# Altium project ESP32_DevBoard_B.PrjPcb
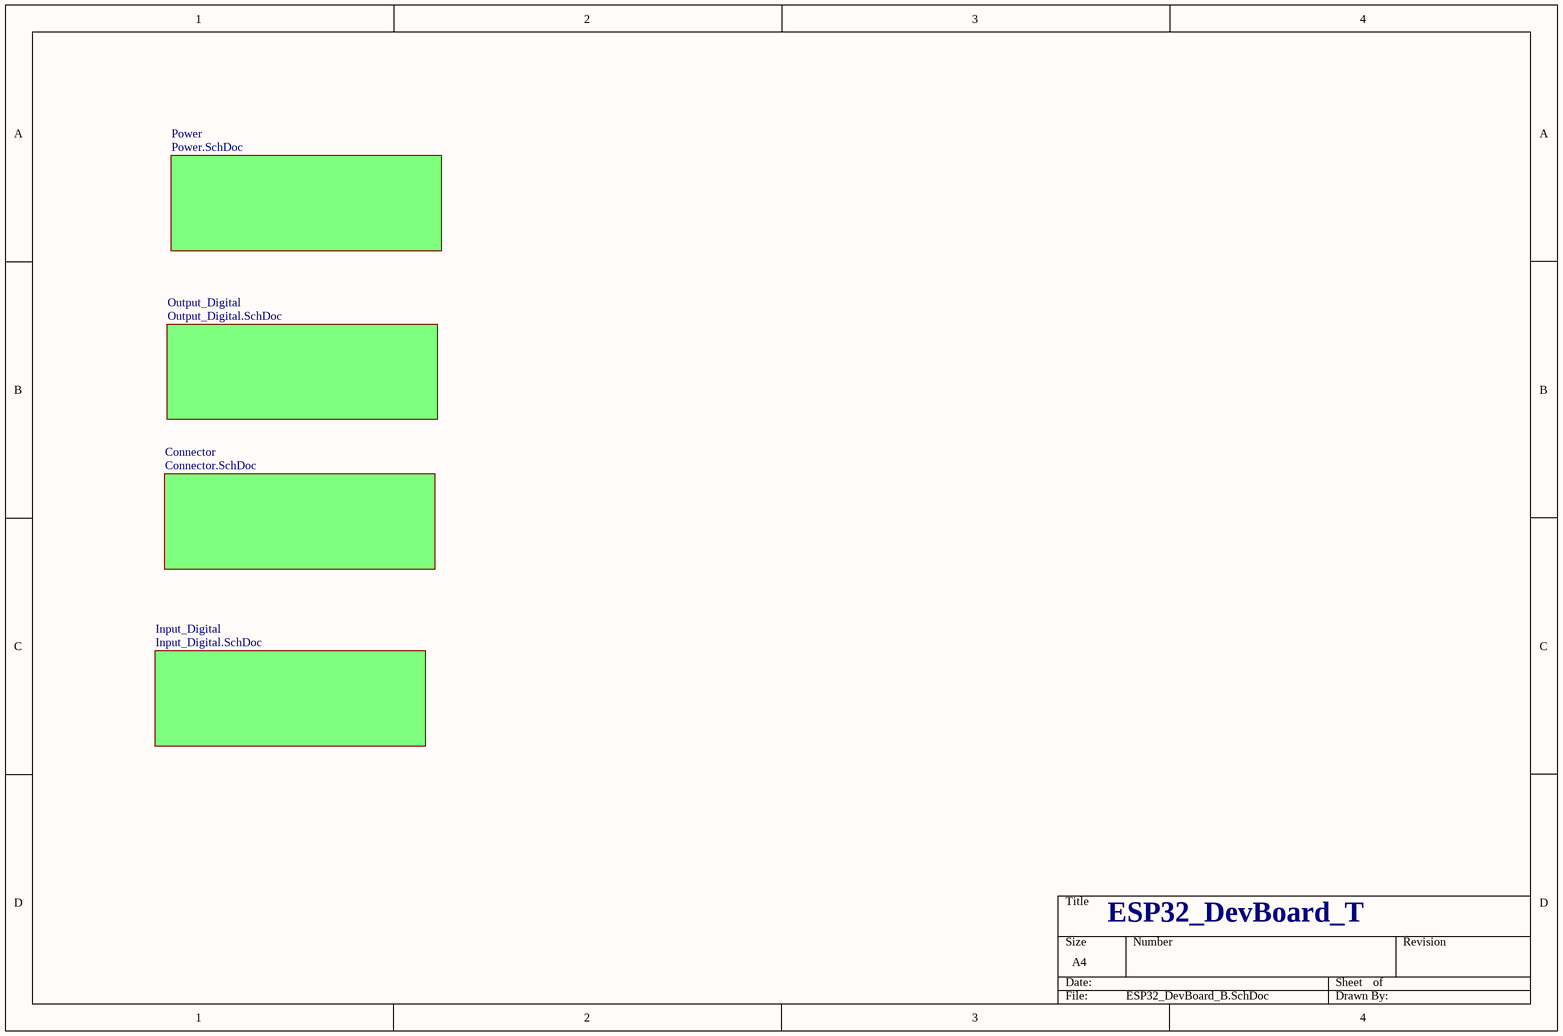
[diagram p0: ESP32_DevBoard_B.SchDoc]
5 sheets, 46 parts. Net scope: flat (ports and power ports of the same name join across sheets).
Sheets:
  ESP32_DevBoard_B.SchDoc
    Power = Power.SchDoc
    Output_Digital = Output_Digital.SchDoc
    Connector = Connector.SchDoc
    Input_Digital = Input_Digital.SchDoc

## Sheet ESP32_DevBoard_B.SchDoc
size A4

### Sub-sheets
Connector = Connector.SchDoc: no entries
Input_Digital = Input_Digital.SchDoc: no entries
Output_Digital = Output_Digital.SchDoc: no entries
Power = Power.SchDoc: no entries

### Notes on the sheet
- ESP32_DevBoard_T

## Sheet Power.SchDoc
size A4
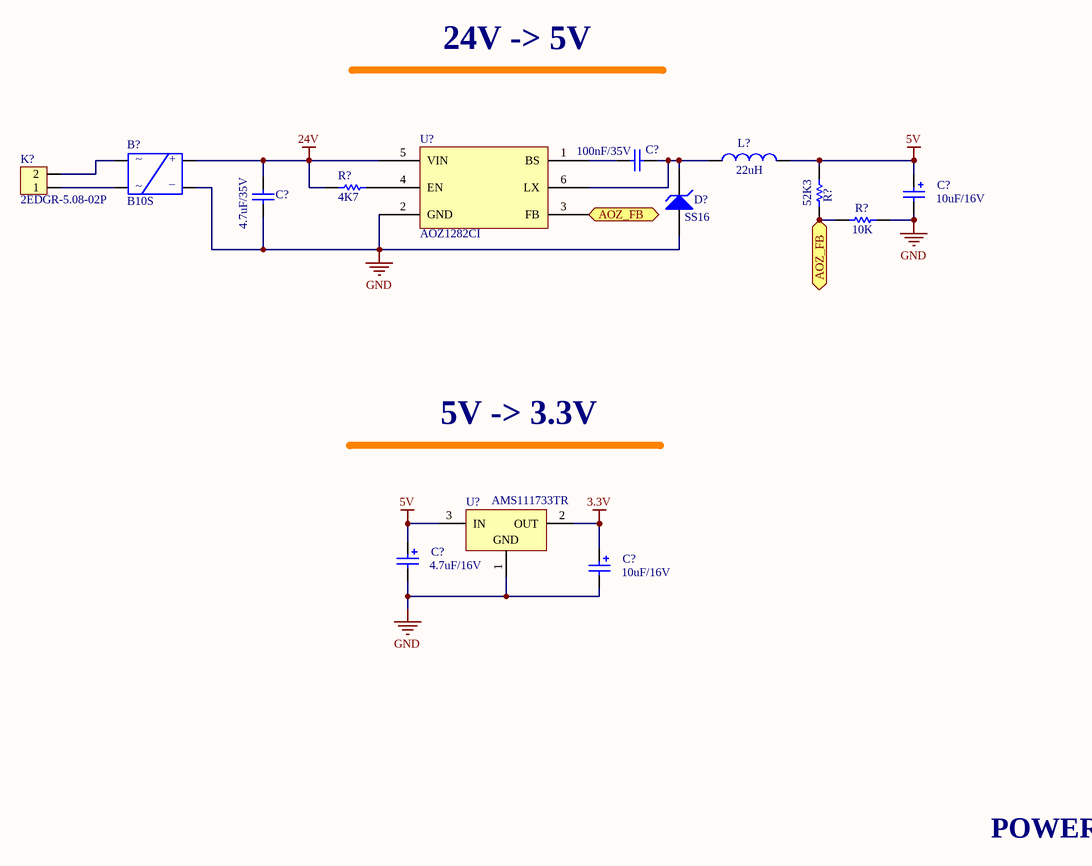
[diagram p1: Power.SchDoc]

### Parts
(Parts that share a designator on the sheet are numbered #1, #2 ... from top to bottom, then left to right.)
B?  B10S  [B10S]
C?#1  100nF/35V  [CAP0603W]
C?#2  10uF/16V  [CAP A]
C?#3  4.7uF/35V  [CAP1206W]
C?#4  4.7uF/16V  [CAP A]
C?#5  10uF/16V  [CAP A]
D?#1  SS16  [DO214AC]
K?#1  2EDGR-5.08-02P  [CON_DG129_02P]
L?  22uH  [INDUCTOR C43]
R?#1  52K3  [RES1608[0603]]
R?#2  4K7  [RES1608[0603]]
R?#3  10K  [RES1608[0603]]
U?#1  AOZ1282CI  [SOT23-6]
U?#2  AMS111733TR  [SOT-223-2]

### Ports
AOZ_FB

### Nets
3.3V: C?#5.1 U?#2.2(OUT)
5V: C?#2.1 C?#4.1 L?.2 R?#1.1 U?#2.3(IN)
24V: B?.3 C?#3.1 R?#2.2 U?#1.5(VIN)
GND: B?.4 C?#2.2 C?#3.2 C?#4.2 C?#5.2 D?#1.1(A) R?#3.1 U?#1.2(GND) U?#2.1(GND)
NetB?_1: B?.1 K?#1.2
NetB?_2: B?.2 K?#1.1
NetC?#1_1: C?#1.1 U?#1.1(BS)
NetC?#1_2: C?#1.2 D?#1.2(K) L?.1 U?#1.6(LX)
NetR?#1_2: R?#1.2 R?#3.2 U?#1.3(FB) ; port AOZ_FB
NetR?#2_1: R?#2.1 U?#1.4(EN)

### Notes on the sheet
- 24V -> 5V
- 5V -> 3.3V
- POWER
- (in symbol BRIDGE RECTIFIER) ~; +; _

### Library data of the parts
B? = BRIDGE RECTIFIER: DIODE B10S MIC SMD; RB156: RB156
C?#1 = CAP1: CAPACITOR 0603 Case; Value: 100nF; Published: 8-Jun-2000; LatestRevisionDate: 17-Jul-2002; LatestRevisionNote: Re-released for DXP Platform.; PackageReference: C1206; Publisher: Altium Limited
C?#2 C?#4 C?#5 = CAP2: CAPACITOR Polarized Capacitor; Value: 100uF; Published: 8-Jun-2000; LatestRevisionDate: 17-Jul-2002; LatestRevisionNote: Re-released for DXP Platform.; PackageReference: RB7.6-15; Publisher: Altium Limited
C?#3 = CAP1: CAPACITOR 1206Case; Value: 100nF; Published: 8-Jun-2000; LatestRevisionDate: 17-Jul-2002; LatestRevisionNote: Re-released for DXP Platform.; PackageReference: C1206; Publisher: Altium Limited
D?#1 = DIODE: DIODE SCHOTTKY SS16 1A 60V DO214AC SMA; Published: 8-Jun-2000; LatestRevisionDate: 17-Jul-2002; LatestRevisionNote: Re-released for DXP Platform.; PackageReference: DIODE-0.7; Publisher: Altium Limited
K?#1 = KLEMENS_2P: CONNECTOR 5.08mm 2PIN 90DEG
L? = INDUCTOR: INDUCTOR 22uH SDR43-220M-LF SMD 4.5X4X3.2MM; Code_IEC: 1005; Published: 8-Jun-2000; LatestRevisionDate: 17-Jul-2002; LatestRevisionNote: Re-released for DXP Platform.; PackageReference: 0402-A; Publisher: Altium Limited; Code_JEITA: 0402
R?#1-R?#3 = RES: RESISTOR 0603 Case %1; Value: 430R; Published: 8-Jun-2000; LatestRevisionDate: 17-Jul-2002; LatestRevisionNote: Re-released for DXP Platform.; PackageReference: AXIAL-0.5; Publisher: Altium Limited
U?#1 = AOZ1282CI: REGULATOR IC-1282 REG BUCK ADJ 1.2A SOT23-6
U?#2 = AMS111733TR: IC-1117 REG LDO 3.3V 1A SOT223; Note: Tab is connected to pin 3 (GND).; Published: 24-Aug-2001; LatestRevisionDate: 17-Jul-2002; LatestRevisionNote: Re-released for DXP Platform.; DatasheetDocument: Dec-1998; PackageDocument: Jun-1998; PackageReference: TO220ABN; Publisher: Altium Limited; ComponentLink1Description: Manufacturer Link; ComponentLink1URL: http://www.st.com/

## Sheet Output_Digital.SchDoc
size A4
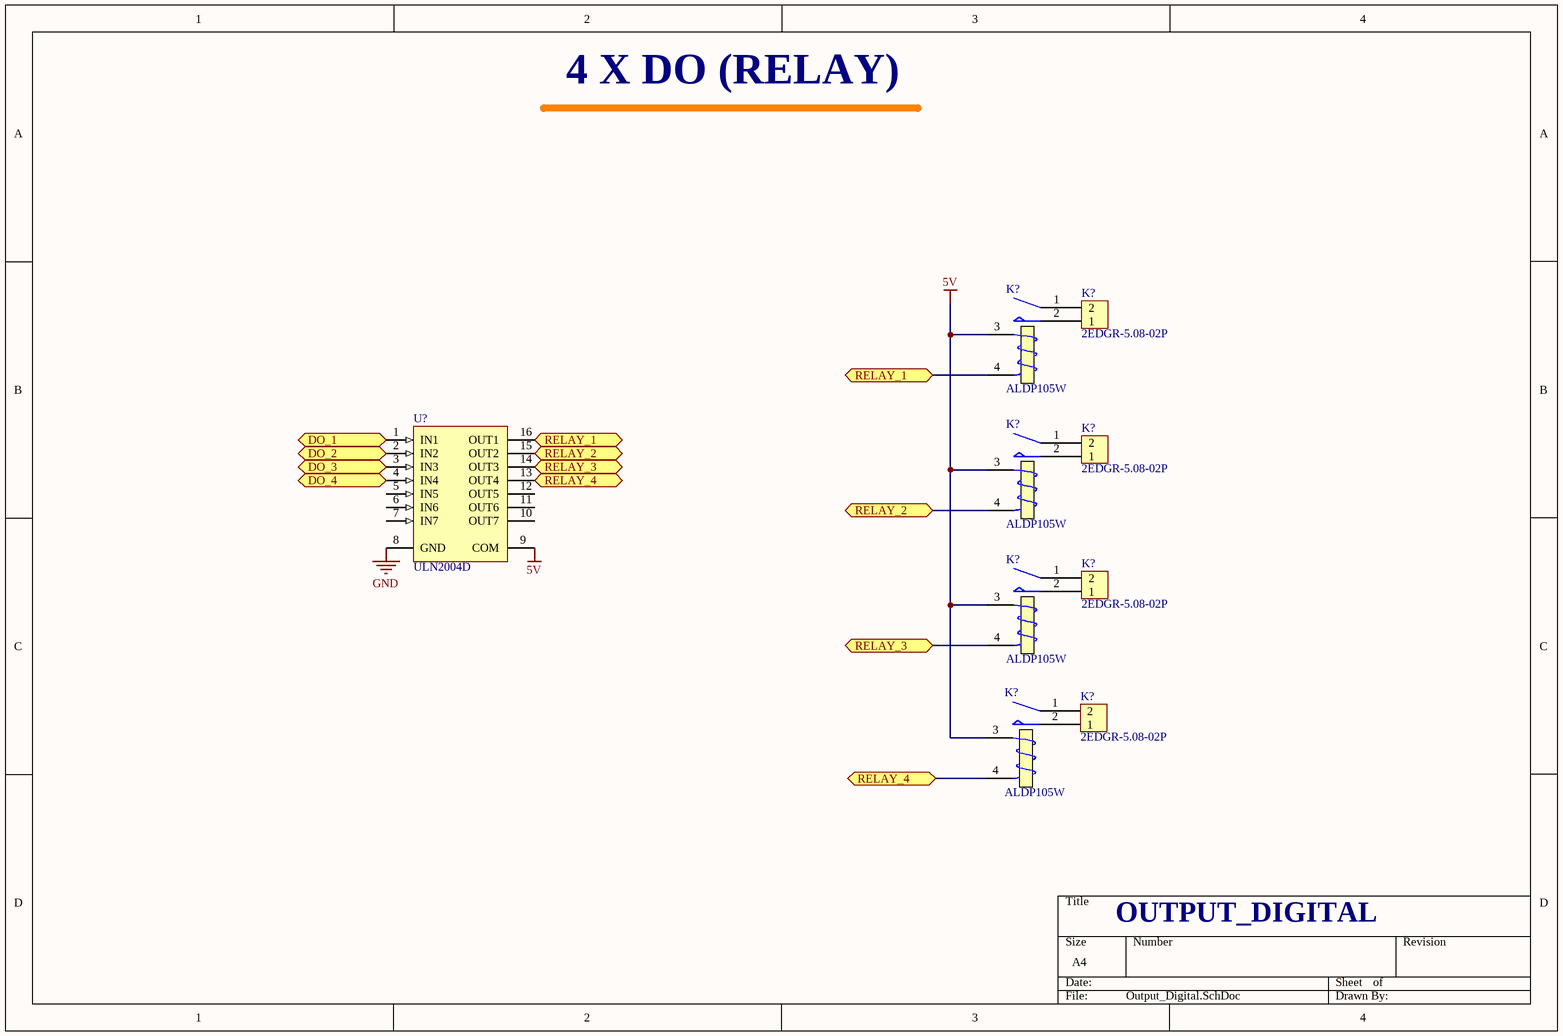
[diagram p2: Output_Digital.SchDoc]

### Parts
(Parts that share a designator on the sheet are numbered #1, #2 ... from top to bottom, then left to right.)
K?#2  ALDP105W  [RELAY_ALDP124W]
K?#3  2EDGR-5.08-02P  [CON_DG129_02P]
K?#4  ALDP105W  [RELAY_ALDP124W]
K?#5  2EDGR-5.08-02P  [CON_DG129_02P]
K?#6  ALDP105W  [RELAY_ALDP124W]
K?#7  2EDGR-5.08-02P  [CON_DG129_02P]
K?#8  ALDP105W  [RELAY_ALDP124W]
K?#9  2EDGR-5.08-02P  [CON_DG129_02P]
U?#3  ULN2004D  [SO16_M]

### Ports
DO_1, DO_2, DO_3, DO_4, RELAY_1, RELAY_2, RELAY_3, RELAY_4

### Nets
5V: K?#2.3(T1) K?#4.3(T1) K?#6.3(T1) K?#8.3(T1) U?#3.9(COM)
GND: U?#3.8(GND)
NetK?#2_1: K?#2.1(COM) K?#3.2
NetK?#2_2: K?#2.2(NO) K?#3.1
NetK?#2_4: K?#2.4(T2) U?#3.16(OUT1) ; port RELAY_1
NetK?#4_1: K?#4.1(COM) K?#5.2
NetK?#4_2: K?#4.2(NO) K?#5.1
NetK?#4_4: K?#4.4(T2) U?#3.15(OUT2) ; port RELAY_2
NetK?#6_1: K?#6.1(COM) K?#7.2
NetK?#6_2: K?#6.2(NO) K?#7.1
NetK?#6_4: K?#6.4(T2) U?#3.14(OUT3) ; port RELAY_3
NetK?#8_1: K?#8.1(COM) K?#9.2
NetK?#8_2: K?#8.2(NO) K?#9.1
NetK?#8_4: K?#8.4(T2) U?#3.13(OUT4) ; port RELAY_4
NetP?_6: U?#3.1(IN1) ; port DO_1
NetP?_8: U?#3.2(IN2) ; port DO_2
NetP?_10: U?#3.3(IN3) ; port DO_3
NetP?_12: U?#3.4(IN4) ; port DO_4

Not connected (* = marked no-connect by the designer): U?#3 5(IN5) 6(IN6) 7(IN7) 10(OUT7) 11(OUT6) 12(OUT5)

### Notes on the sheet
- 4 X DO (RELAY)
- OUTPUT_DIGITAL

### Library data of the parts
K?#2 K?#4 K?#6 K?#8 = RELAY_ALDP124W: RELAY PANASONIC ALDP105W 5A; Published: 8-Jun-2000; LatestRevisionDate: 17-Jul-2002; LatestRevisionNote: Re-released for DXP Platform.; PackageReference: MODULE5B; Publisher: Altium Limited
K?#3 K?#5 K?#7 K?#9 = KLEMENS_2P: CONNECTOR 5.08mm 2PIN 90DEG
U?#3 = ULN2004D: IC Seven Darlington Array Integrated suppression diodes for inductive  loads; Published: 8-Jun-2000; LatestRevisionDate: 13-Apr-2006; LatestRevisionNote: IPC-7351 Footprint Added.; DatasheetVersion: Sep-1998; PackageVersion: May-1998; PackageReference: SO16; Publisher: Altium Limited; PackageDescription: 16-Pin Small Outline Integrated Circuit 1.27 mm Pitch; Code_IPC: SOIC127P600-16; ComponentLink1Description: Manufacturer Link; ComponentLink1URL: http://www.st.com/; ComponentLink2Description: Datasheet; ComponentLink2URL: http://www.st.com/stonline/products/literature/ds/5279/uln2001.pdf

## Sheet Connector.SchDoc
size A4
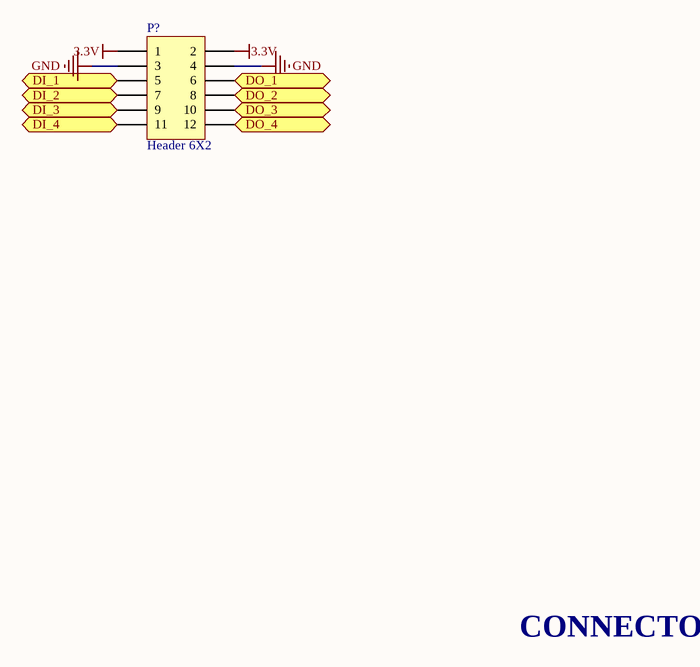
[diagram p3: Connector.SchDoc]

### Parts
P?  Header 6X2  [HDR2X6]

### Ports
DI_1, DI_2, DI_3, DI_4, DO_1, DO_2, DO_3, DO_4

### Nets
3.3V: P?.1 P?.2
GND: P?.3 P?.4
NetP?_5: P?.5 ; port DI_1
NetP?_6: P?.6 ; port DO_1
NetP?_7: P?.7 ; port DI_2
NetP?_8: P?.8 ; port DO_2
NetP?_9: P?.9 ; port DI_3
NetP?_10: P?.10 ; port DO_3
NetP?_11: P?.11 ; port DI_4
NetP?_12: P?.12 ; port DO_4

### Notes on the sheet
- CONNECTOR

### Library data of the parts
P? = Header 6X2: CONNECTOR Header, 6-Pin, Dual row; LatestRevisionDate: 17-Jul-2002; LatestRevisionNote: Re-released for DXP Platform.; Publisher: Altium Limited

## Sheet Input_Digital.SchDoc
size A4
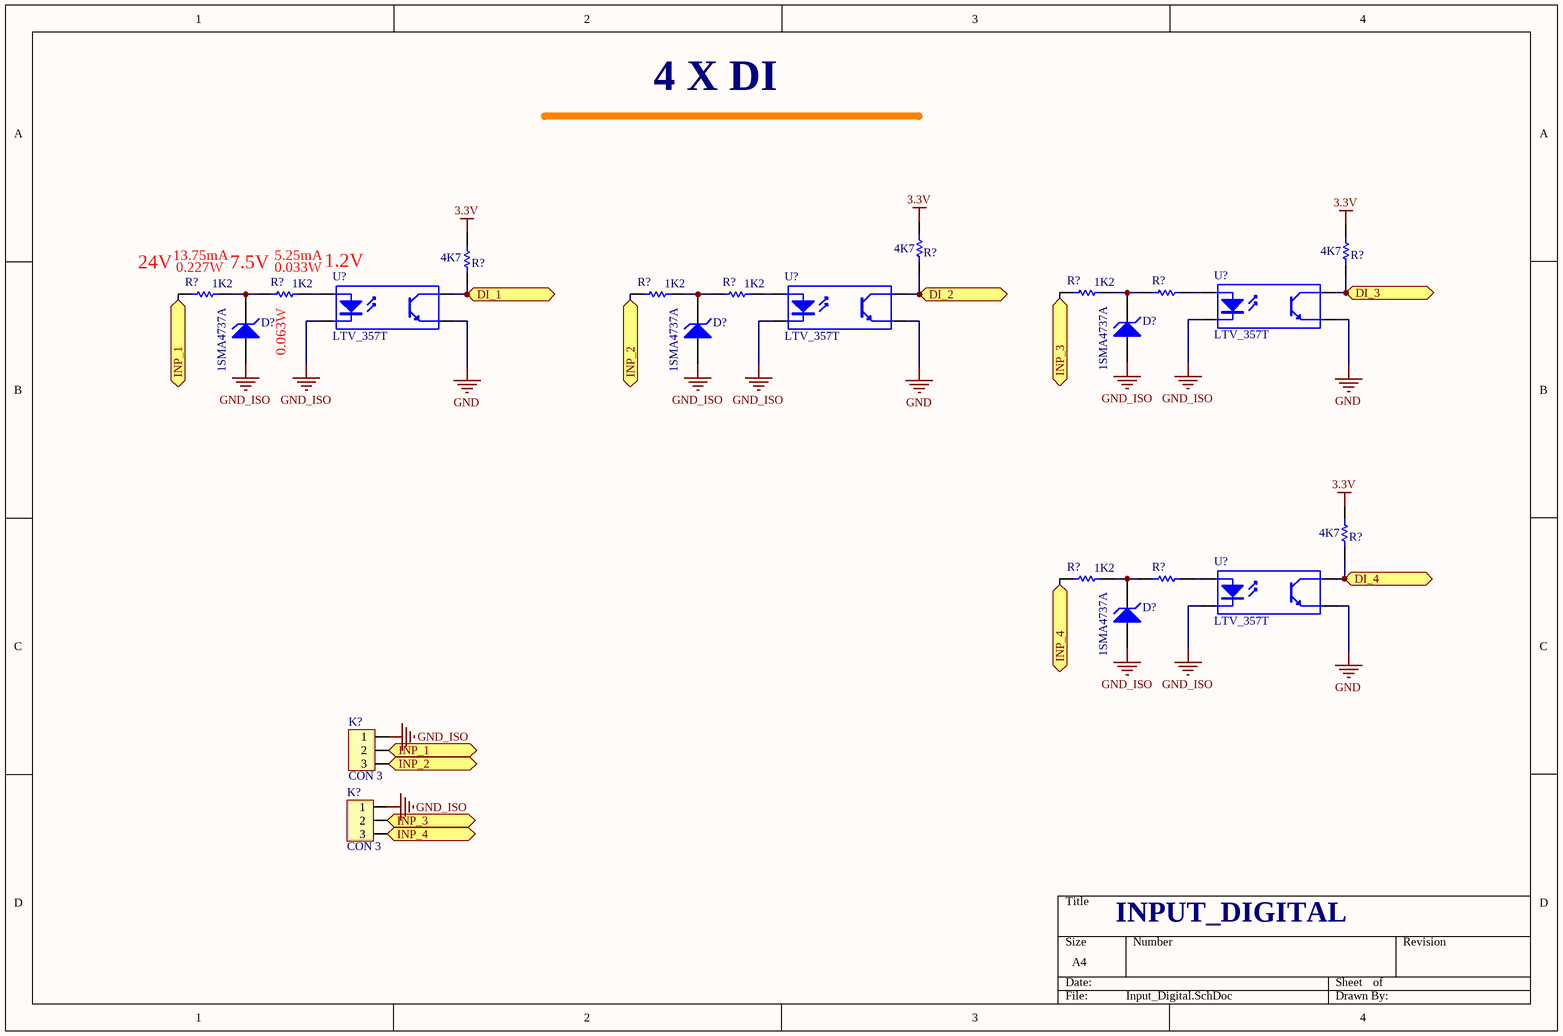
[diagram p4: Input_Digital.SchDoc]

### Parts
(Parts that share a designator on the sheet are numbered #1, #2 ... from top to bottom, then left to right.)
D?#2  1SMA4737A  [DO214AC]
D?#3  1SMA4737A  [DO214AC]
D?#4  1SMA4737A  [DO214AC]
D?#5  1SMA4737A  [DO214AC]
K?#10  CON 3  [CON03P180]
K?#11  CON 3  [CON03P180]
R?#4  4K7  [RES1608[0603]]
R?#5  4K7  [RES1608[0603]]
R?#6  4K7  [RES1608[0603]]
R?#7  1K2  [RES3216[1206]]
R?#8  1K2  [RES2012[0805]]
R?#9  1K2  [RES3216[1206]]
R?#10  1K2  [RES2012[0805]]
R?#11  1K2  [RES3216[1206]]
R?#12  1K2  [RES2012[0805]]  (value not drawn)
R?#13  4K7  [RES1608[0603]]
R?#14  1K2  [RES3216[1206]]
R?#15  1K2  [RES2012[0805]]  (value not drawn)
U?#4  LTV_357T  [SMD-4]
U?#5  LTV_357T  [SMD-4]
U?#6  LTV_357T  [SMD-4]
U?#7  LTV_357T  [SMD-4]

### Ports
DI_1, DI_2, DI_3, DI_4, INP_1, INP_2, INP_3, INP_4

### Nets
3.3V: R?#4.2 R?#5.2 R?#6.2 R?#13.2
GND: U?#4.3(E) U?#5.3(E) U?#6.3(E) U?#7.3(E)
GND_ISO: D?#2.1(A) D?#3.1(A) D?#4.1(A) D?#5.1(A) K?#10.1 K?#11.1 U?#4.2(K) U?#5.2(K) U?#6.2(K) U?#7.2(K)
NetD?#2_2: D?#2.2(K) R?#7.1 R?#8.2
NetD?#3_2: D?#3.2(K) R?#9.1 R?#10.2
NetD?#4_2: D?#4.2(K) R?#11.1 R?#12.2
NetD?#5_2: D?#5.2(K) R?#14.1 R?#15.2
NetK?#10_2: K?#10.2 R?#7.2 ; port INP_1
NetK?#10_3: K?#10.3 R?#9.2 ; port INP_2
NetK?#11_2: K?#11.2 R?#11.2 ; port INP_3
NetK?#11_3: K?#11.3 R?#14.2 ; port INP_4
NetP?_5: R?#6.1 U?#4.4(C) ; port DI_1
NetP?_7: R?#4.1 U?#5.4(C) ; port DI_2
NetP?_9: R?#5.1 U?#6.4(C) ; port DI_3
NetP?_11: R?#13.1 U?#7.4(C) ; port DI_4
NetR?#8_1: R?#8.1 U?#4.1(A)
NetR?#10_1: R?#10.1 U?#5.1(A)
NetR?#12_1: R?#12.1 U?#6.1(A)
NetR?#15_1: R?#15.1 U?#7.1(A)

### Notes on the sheet
- 4 X DI
- (near R?#7) 24V
- (near R?#7) 13.75mA
- (near R?#7) 0.227W
- (near R?#8) 7.5V
- 5.25mA
- 0.033W
- 1.2V
- 0.063W
- INPUT_DIGITAL

### Library data of the parts
D?#2-D?#5 = DIODE: DIODE Zener Diode 7.5V 1W DO214AC; Published: 8-Jun-2000; LatestRevisionDate: 17-Jul-2002; LatestRevisionNote: Re-released for DXP Platform.; PackageReference: DIODE-0.7; Publisher: Altium Limited
K?#10 K?#11 = KLEMENS_3P: Klemens 5.08mm 3lü
R?#4-R?#6 R?#13 = RES: Semiconductor Resistor; Value: 430R; Published: 8-Jun-2000; LatestRevisionDate: 17-Jul-2002; LatestRevisionNote: Re-released for DXP Platform.; PackageReference: AXIAL-0.5; Publisher: Altium Limited
R?#7 R?#9 R?#11 R?#14 = RES: RESISTOR 1206 Case %1; Value: 430R; Published: 8-Jun-2000; LatestRevisionDate: 17-Jul-2002; LatestRevisionNote: Re-released for DXP Platform.; PackageReference: AXIAL-0.5; Publisher: Altium Limited
R?#8 R?#10 R?#12 R?#15 = RES: RESISTOR 0805 Case %1; Value: 430R; Published: 8-Jun-2000; LatestRevisionDate: 17-Jul-2002; LatestRevisionNote: Re-released for DXP Platform.; PackageReference: AXIAL-0.5; Publisher: Altium Limited
U?#4-U?#7 = LVT_357T: OPTOCOUPLER Transistor Output Optocouplers Optocoupler Phototrans; Published: 24-Mar-1999; LatestRevisionDate: 04-Mar-2005; LatestRevisionNote: Sch pins 3 & 4 Swapped.; DatasheetDocument: Nov-2003; PackageReference: DIP-4; Publisher: Altium Limited

## Nets that join several sheets
3.3V: Power (C?#5.1 U?#2.2), Connector (P?.1 P?.2), Input_Digital (R?#4.2 R?#5.2 R?#6.2 R?#13.2)
5V: Power (5 pins), Output_Digital (5 pins)
GND: Power (9 pins), Output_Digital (U?#3.8), Connector (P?.3 P?.4), Input_Digital (U?#4.3 U?#5.3 U?#6.3 U?#7.3)
NetP?_5: Connector (P?.5), Input_Digital (R?#6.1 U?#4.4)
NetP?_6: Output_Digital (U?#3.1), Connector (P?.6)
NetP?_7: Connector (P?.7), Input_Digital (R?#4.1 U?#5.4)
NetP?_8: Output_Digital (U?#3.2), Connector (P?.8)
NetP?_9: Connector (P?.9), Input_Digital (R?#5.1 U?#6.4)
NetP?_10: Output_Digital (U?#3.3), Connector (P?.10)
NetP?_11: Connector (P?.11), Input_Digital (R?#13.1 U?#7.4)
NetP?_12: Output_Digital (U?#3.4), Connector (P?.12)